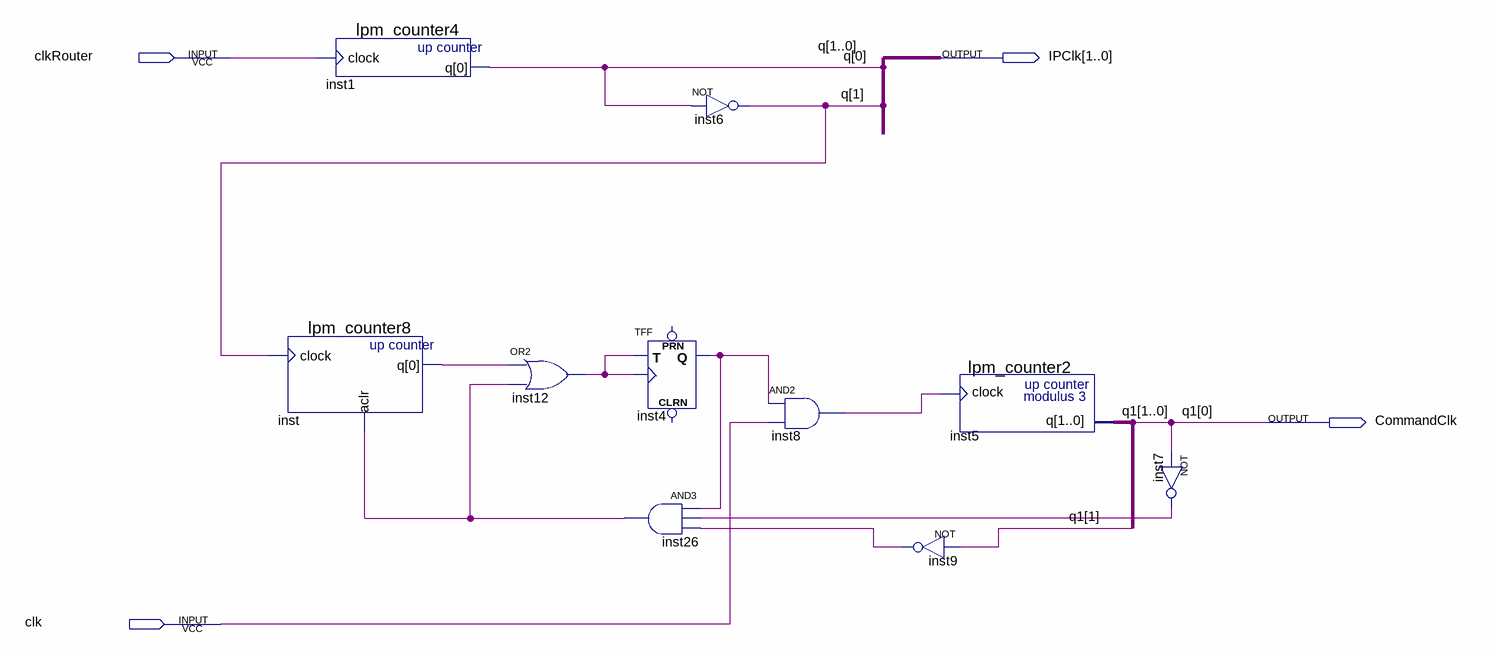
[diagram p0: schematic sheet]
// Quartus schematic ClkRouter.bdf as structural Verilog: 10 symbols, 4 pins
module ClkRouter (
  input  clkRouter,
  input  clk,
  output [1:0] IPClk,
  output CommandClk
);

  wire inst4_q, inst7_out, inst8_out, inst9_out, inst12_out, inst26_out, inst_q;
  wire [1:1] q1;

  lpm_counter4 inst1 (.clock(clkRouter), .q(IPClk[0]));
  lpm_counter8 inst (.clock(IPClk[1]), .aclr(inst26_out), .q(inst_q));
  or inst12 (inst12_out, inst_q, inst26_out);
  TFF inst4 (.T(inst12_out), .CLK(inst12_out), .Q(inst4_q));  // open: PRN, CLRN
  and inst26 (inst26_out, inst4_q, inst7_out, inst9_out);
  not inst6 (IPClk[1], IPClk[0]);
  and inst8 (inst8_out, inst4_q, clk);
  lpm_counter2 inst5 (.clock(inst8_out), .q({q1[1], CommandClk}));
  not inst9 (inst9_out, q1[1]);
  not inst7 (inst7_out, CommandClk);

  // Other names for the same wires on the sheet: q[1:0] = IPClk; q1[0] = CommandClk
endmodule
